# Altium schematic sheet USB.SchDoc
size A3
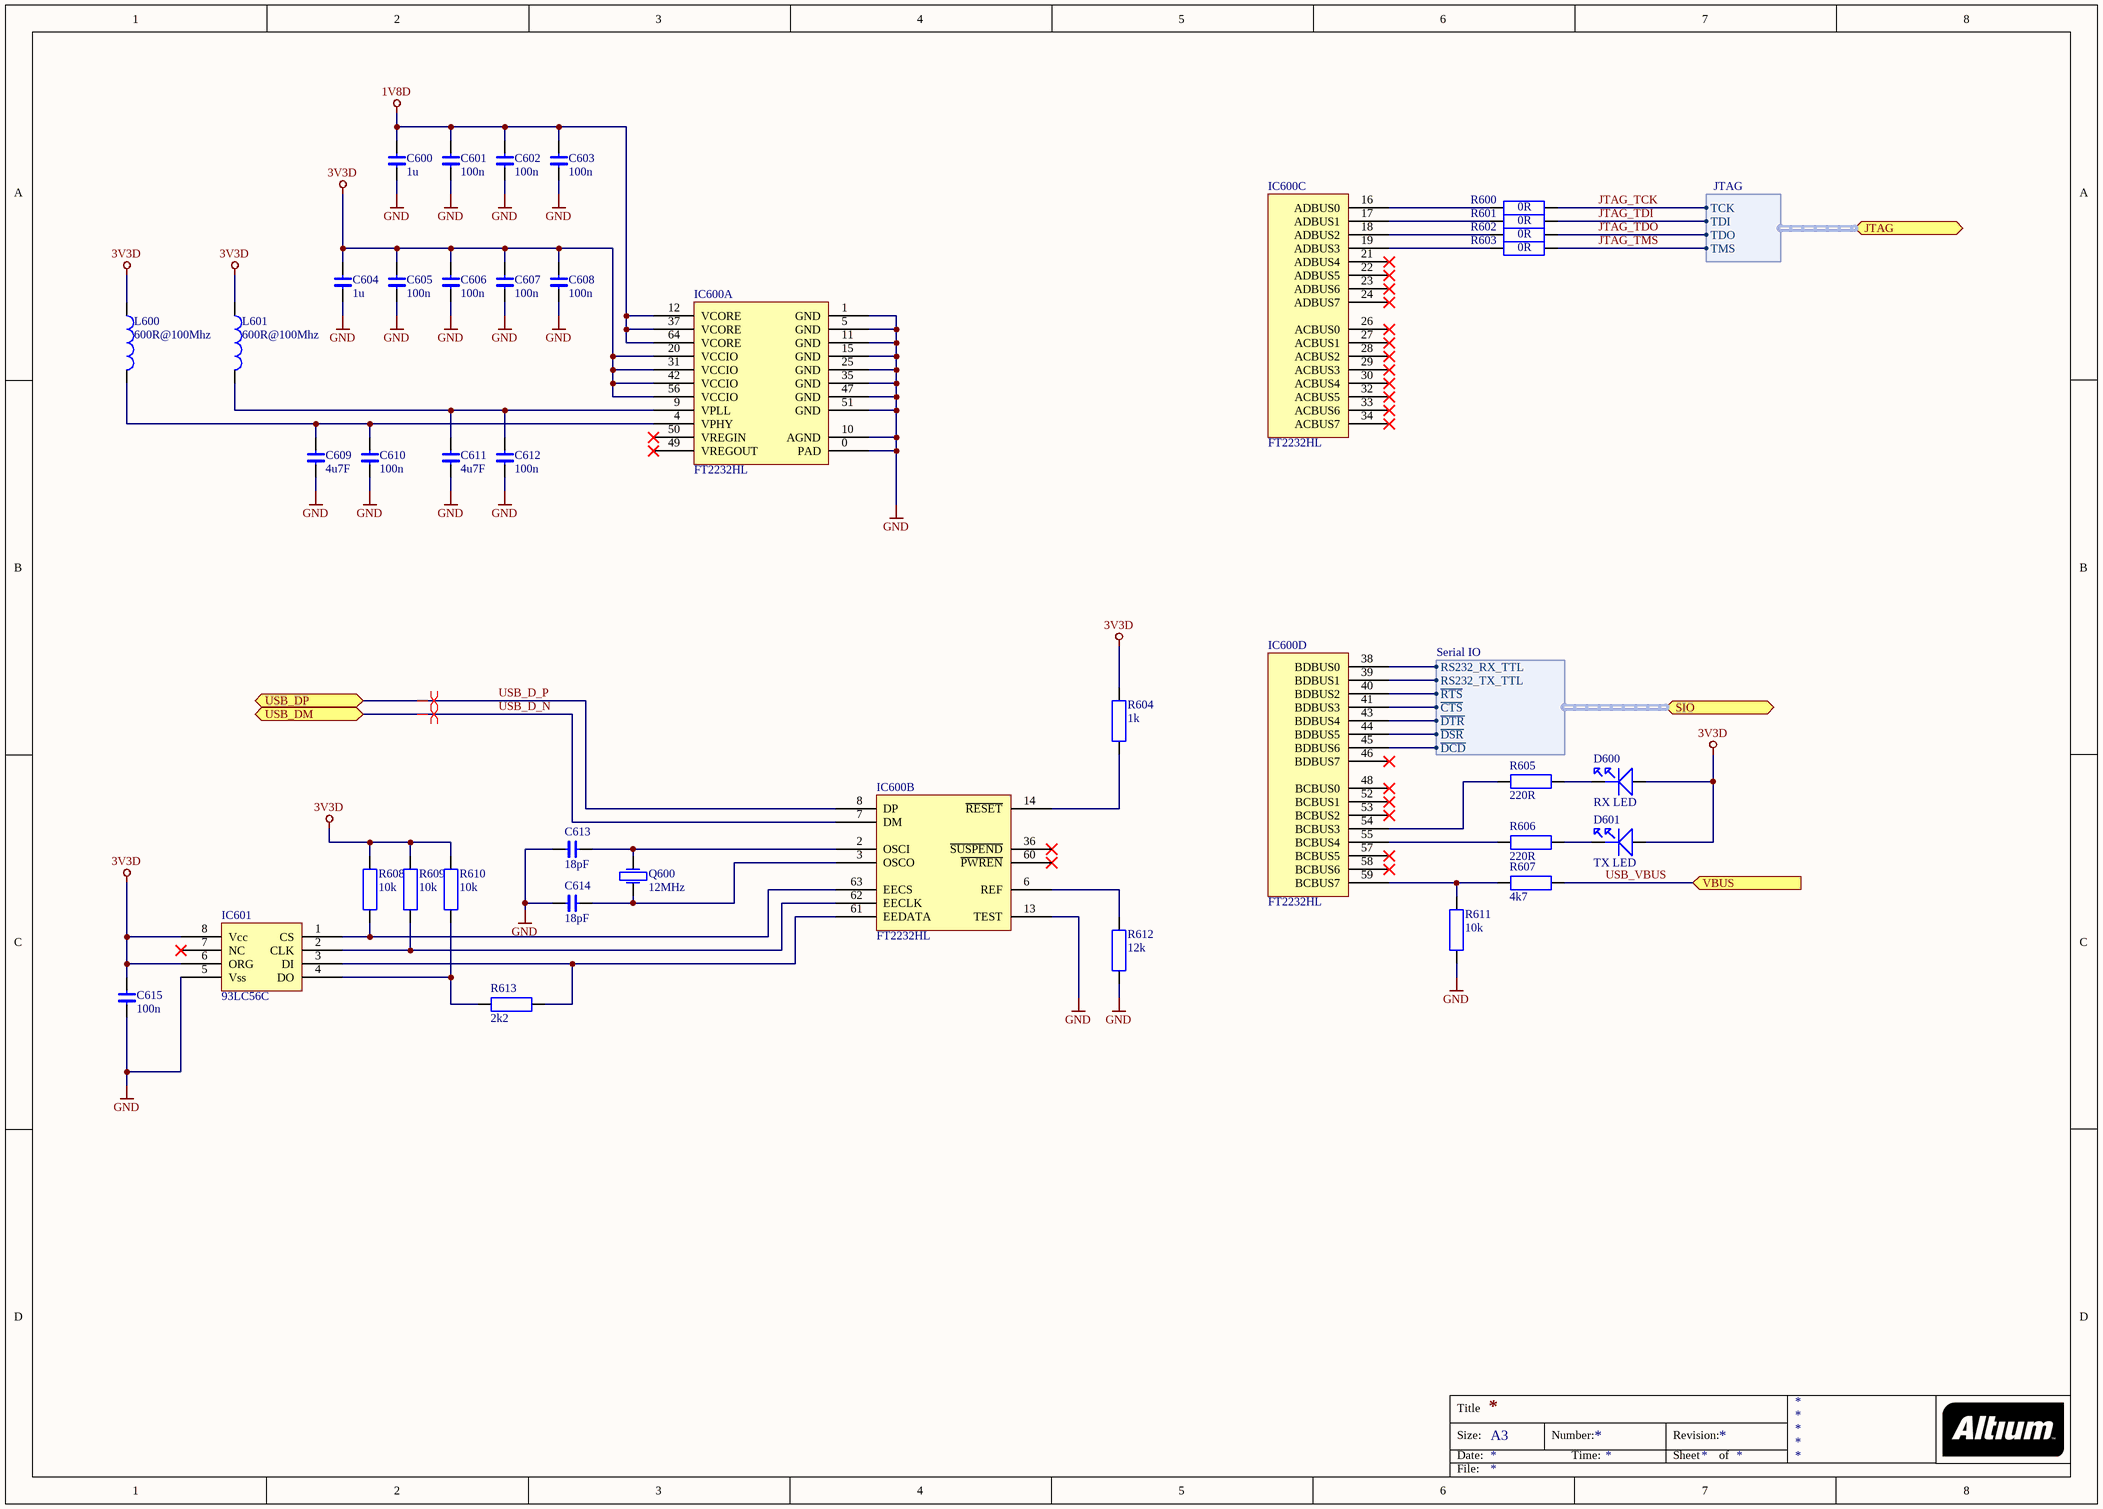
[diagram p0: USB.SchDoc]

## Parts
C600  1u  [0603 SMALL OUTLINE]
C601  100n  [0603 SMALL OUTLINE]
C602  100n  [0603 SMALL OUTLINE]
C603  100n  [0603 SMALL OUTLINE]
C604  1u  [0603 SMALL OUTLINE]
C605  100n  [0603 SMALL OUTLINE]
C606  100n  [0603 SMALL OUTLINE]
C607  100n  [0603 SMALL OUTLINE]
C608  100n  [0603 SMALL OUTLINE]
C609  4u7F  [0603 SMALL OUTLINE]
C610  100n  [0603 SMALL OUTLINE]
C611  4u7F  [0603 SMALL OUTLINE]
C612  100n  [0603 SMALL OUTLINE]
C613  18pF  [0603 SMALL OUTLINE]
C614  18pF  [0603 SMALL OUTLINE]
C615  100n  [0603 SMALL OUTLINE]
D600  RX LED  [LED SMD 0603]
D601  TX LED  [LED SMD 0603]
IC600  FT2232HL  [64QFN]  (parts A,B,C,D of 4)
IC601  93LC56C  [MSOP8]
L600  600R@100Mhz  [0805]
L601  600R@100Mhz  [0805]
Q600  12MHz  [SMD_XTAL_5x3.2]
R600  0R  [0603 SMALL OUTLINE]
R601  0R  [0603 SMALL OUTLINE]
R602  0R  [0603 SMALL OUTLINE]
R603  0R  [0603 SMALL OUTLINE]
R604  1k  [0603 SMALL OUTLINE]
R605  220R  [0603 SMALL OUTLINE]
R606  220R  [0603 SMALL OUTLINE]
R607  4k7  [0603 SMALL OUTLINE]
R608  10k  [0603 SMALL OUTLINE]
R609  10k  [0603 SMALL OUTLINE]
R610  10k  [0603 SMALL OUTLINE]
R611  10k  [0603 SMALL OUTLINE]
R612  12k  [0603 SMALL OUTLINE]
R613  2k2  [0603 SMALL OUTLINE]

## Ports
JTAG (harness JTAG), SIO (harness Serial IO), USB_DM (bidir), USB_DP (bidir), VBUS (in)

## Harnesses
JTAG: TCK, TDI, TDO, TMS
Serial IO: RS232_RX_TTL, RS232_TX_TTL, ~{RTS}, ~{CTS}, ~{DTR}, ~{DSR}, ~{DCD}

## Nets
1V8D: C600.1 C601.1 C602.1 C603.1 IC600.12(VCORE) IC600.37(VCORE) IC600.64(VCORE)
3V3D: C604.1 C605.1 C606.1 C607.1 C608.1 C615.1 D600.A D601.A IC600.20(VCCIO) IC600.31(VCCIO) IC600.42(VCCIO) IC600.56(VCCIO) IC601.6(ORG) IC601.8(Vcc) L600.1 L601.1 R604.2 R608.2 R609.2 R610.2
GND: C600.2 C601.2 C602.2 C603.2 C604.2 C605.2 C606.2 C607.2 C608.2 C609.2 C610.2 C611.2 C612.2 C613.2 C614.2 C615.2 IC600.0(PAD) IC600.1(GND) IC600.5(GND) IC600.10(AGND) IC600.11(GND) IC600.13(TEST) IC600.15(GND) IC600.25(GND) IC600.35(GND) IC600.47(GND) IC600.51(GND) IC601.5(Vss) R611.1 R612.1
JTAG_TCK: R600.2 ; port JTAG.TCK
JTAG_TDI: R601.2 ; port JTAG.TDI
JTAG_TDO: R602.2 ; port JTAG.TDO
JTAG_TMS: R603.2 ; port JTAG.TMS
USB_D_N: IC600.7(DM) ; port USB_DM
USB_D_P: IC600.8(DP) ; port USB_DP
USB_VBUS: R607.1 ; port VBUS
NetC609_1: C609.1 C610.1 IC600.4(VPHY) L600.2
NetC611_1: C611.1 C612.1 IC600.9(VPLL) L601.2
NetC613_1: C613.1 IC600.2(OSCI) Q600.2
NetC614_1: C614.1 IC600.3(OSCO) Q600.1
NetD600_K: D600.K R605.1
NetD601_K: D601.K R606.1
NetIC600_6: IC600.6(REF) R612.2
NetIC600_14: IC600.14(~{RESET}) R604.1
NetIC600_16: IC600.16(ADBUS0) R600.1
NetIC600_17: IC600.17(ADBUS1) R601.1
NetIC600_18: IC600.18(ADBUS2) R602.1
NetIC600_19: IC600.19(ADBUS3) R603.1
NetIC600_38: IC600.38(BDBUS0) ; port SIO.RS232_RX_TTL
NetIC600_39: IC600.39(BDBUS1) ; port SIO.RS232_TX_TTL
NetIC600_40: IC600.40(BDBUS2) ; port SIO.~{RTS}
NetIC600_41: IC600.41(BDBUS3) ; port SIO.~{CTS}
NetIC600_43: IC600.43(BDBUS4) ; port SIO.~{DTR}
NetIC600_44: IC600.44(BDBUS5) ; port SIO.~{DSR}
NetIC600_45: IC600.45(BDBUS6) ; port SIO.~{DCD}
NetIC600_54: IC600.54(BCBUS3) R605.2
NetIC600_55: IC600.55(BCBUS4) R606.2
NetIC600_59: IC600.59(BCBUS7) R607.2 R611.2
NetIC600_61: IC600.61(EEDATA) IC601.3(DI) R613.2
NetIC600_62: IC600.62(EECLK) IC601.2(CLK) R609.1
NetIC600_63: IC600.63(EECS) IC601.1(CS) R608.1
NetIC601_4: IC601.4(DO) R610.1 R613.1

Not connected (* = marked no-connect by the designer): IC600 21(ADBUS4)* 22(ADBUS5)* 23(ADBUS6)* 24(ADBUS7)* 26(ACBUS0)* 27(ACBUS1)* 28(ACBUS2)* 29(ACBUS3)* 30(ACBUS4)* 32(ACBUS5)* 33(ACBUS6)* 34(ACBUS7)* 36(~{SUSPEND})* 46(BDBUS7)* 48(BCBUS0)* 49(VREGOUT)* 50(VREGIN)* 52(BCBUS1)* 53(BCBUS2)* 57(BCBUS5)* 58(BCBUS6)* 60(~{PWREN})*; IC601 7(NC)*

## Layout directives
differential pair: USB_D_N, USB_D_P

## Notes on the sheet
- Title
- Size:
- Date:
- A3
- Number:
- Time:
- Revision:
- Sheet
- of
- File:

## Library data of the parts
C600-C615 = C
D600 D601 = LED SMD: WURTH 150060VS75000
IC600 = FT2232HL: DUAL HIGH SPEED USB TO MULTIPURPOSE UART/FIFO IC
IC601 = 93LC56C: 2K Microwire Compatible Serial EEPROM
L600 L601 = L
Q600 = CRYSTAL: XX MHz
R600-R613 = R